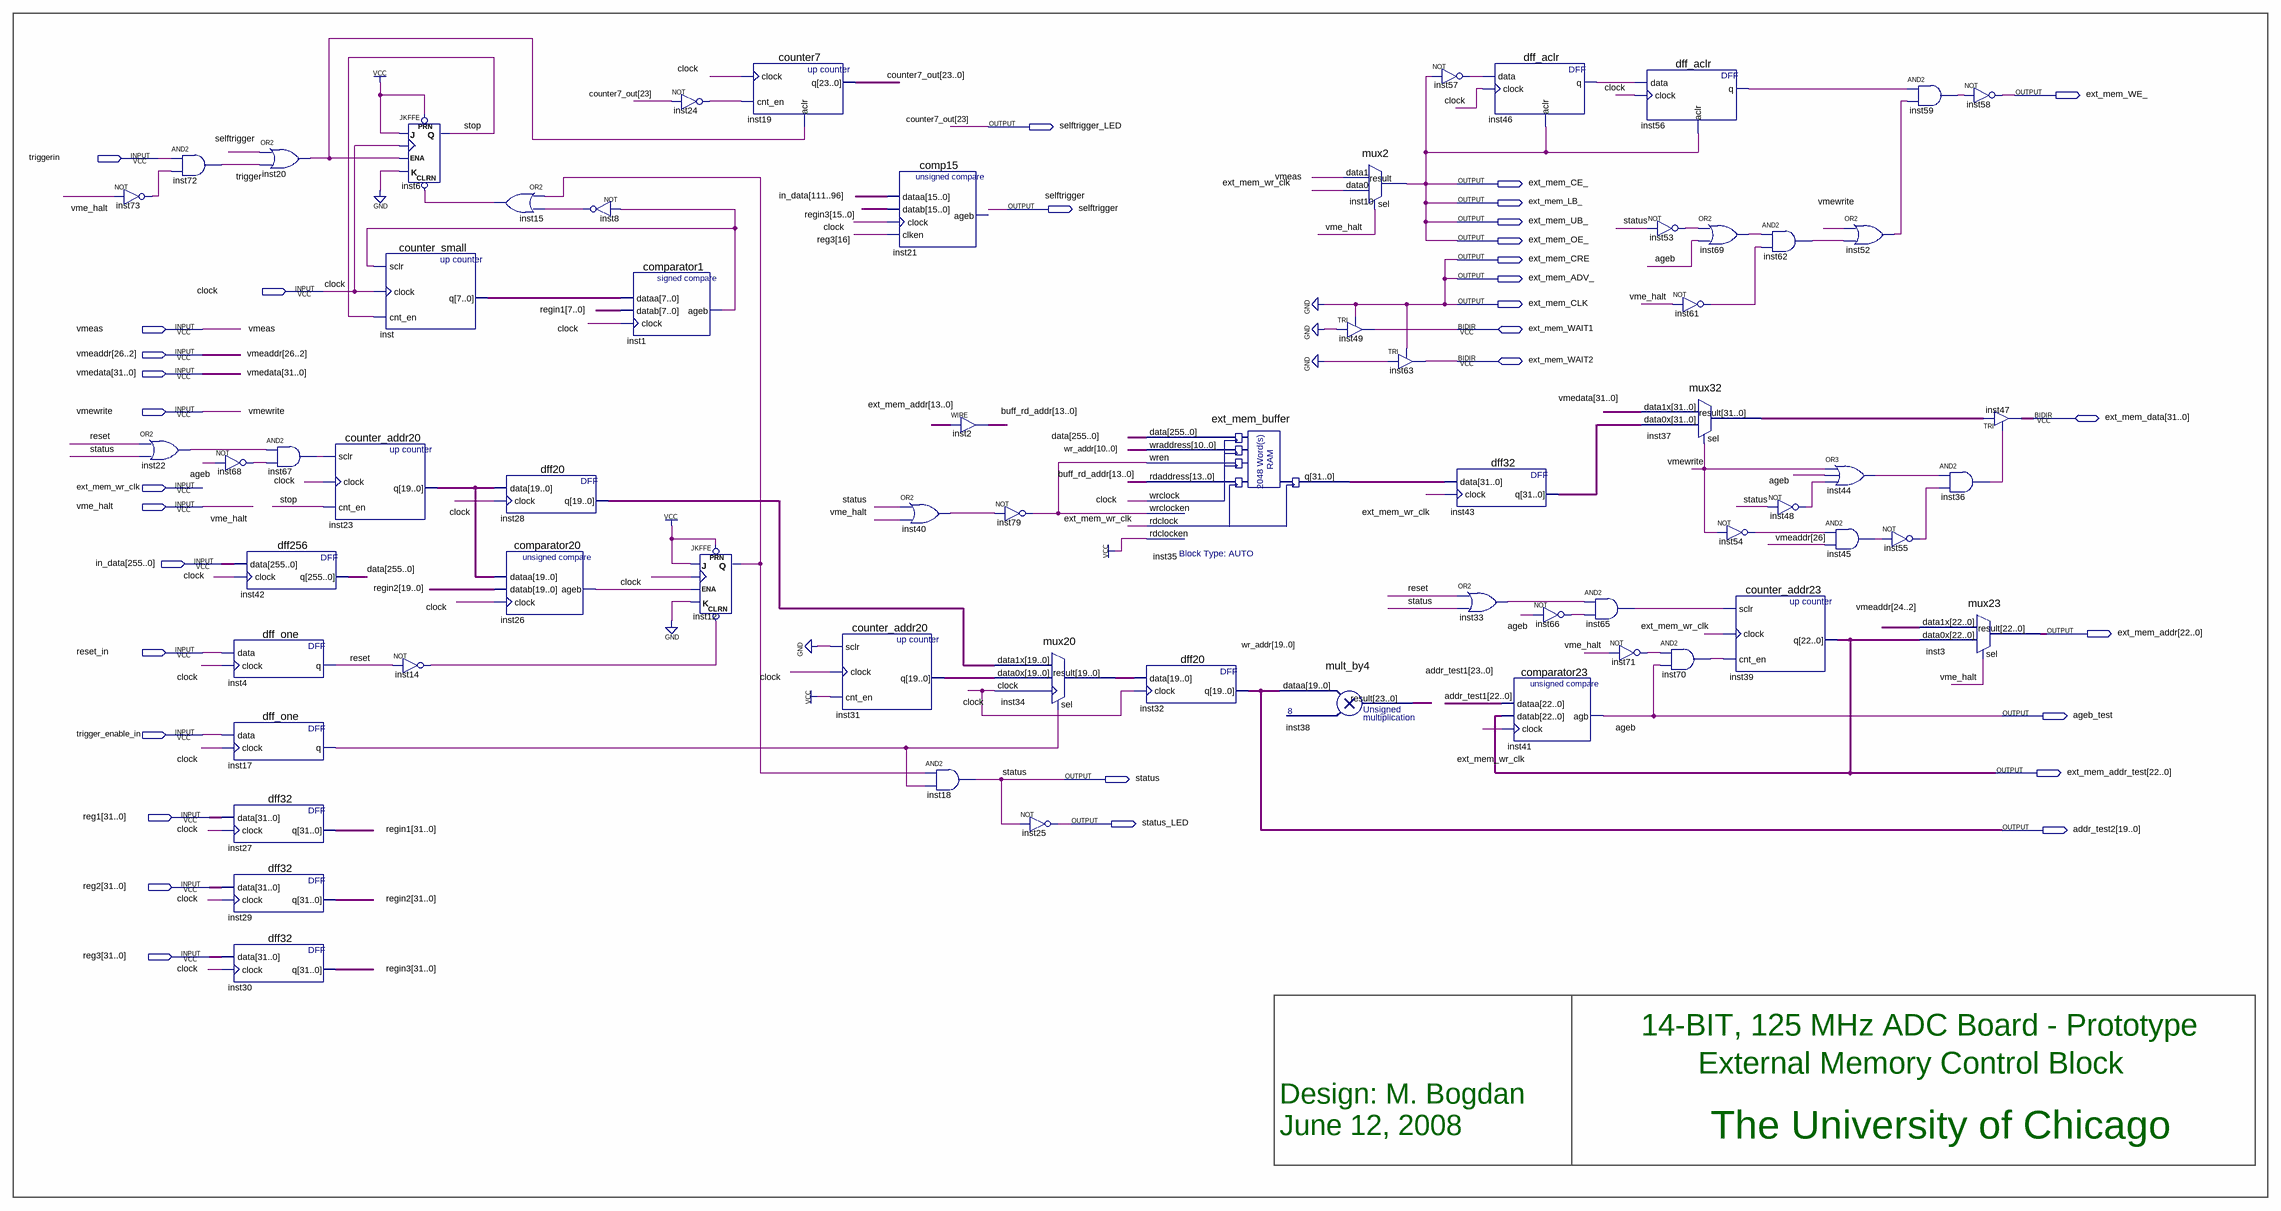
[diagram p0: schematic sheet]
// Quartus schematic ext_mem_trigger_control.bdf as structural Verilog: 65 symbols, 33 pins
module ext_mem_trigger_control (
  input  triggerin,
  input  clock,
  input  vmeas,
  input  [26:2] vmeaddr,
  input  [31:0] vmedata,
  input  vmewrite,
  input  ext_mem_wr_clk,
  input  vme_halt,
  input  [255:0] in_data,
  input  reset_in,
  input  trigger_enable_in,
  input  [31:0] reg1,
  input  [31:0] reg2,
  input  [31:0] reg3,
  inout  ext_mem_WAIT1,
  inout  ext_mem_WAIT2,
  inout  [31:0] ext_mem_data,
  output ext_mem_WE_,
  output selftrigger_LED,
  output ext_mem_CE_,
  output ext_mem_LB_,
  output selftrigger,
  output ext_mem_UB_,
  output ext_mem_OE_,
  output ext_mem_CRE,
  output ext_mem_ADV_,
  output ext_mem_CLK,
  output [22:0] ext_mem_addr,
  output ageb_test,
  output [22:0] ext_mem_addr_test,
  output status,
  output status_LED,
  output [19:0] addr_test2
);

  wire inst1_ageb, inst8_out, inst12_q, inst14_out, inst15_out, inst17_q, inst20_out, inst22_out, inst24_out,
       inst26_ageb, inst33_out, inst36_out, inst40_out, inst44_out, inst45_out, inst46_q, inst48_out,
       inst52_out, inst53_out, inst54_out, inst55_out, inst56_q, inst57_out, inst59_out, inst61_out,
       inst62_out, inst65_out, inst66_out, inst67_out, inst68_out, inst69_out, inst70_out, inst71_out,
       inst73_out, inst79_out, reset, stop, trigger;
  wire [7:0] inst_q;
  wire [13:0] buff_rd_addr;
  wire [19:0] inst23_q, inst28_q, inst31_q, inst34_result;
  wire [22:0] counter7_out;
  wire [23:0] addr_test1;
  wire [31:0] inst35_q, inst37_result, inst43_q, regin1, regin2, regin3;
  wire [255:0] data;

  not inst73 (inst73_out, vme_halt);
  or inst22 (inst22_out, reset, status);
  and inst72 (trigger, triggerin, inst73_out);
  not inst68 (inst68_out, ageb_test);
  dff256 inst42 (.data(in_data), .clock(clock), .q(data));
  dff_one inst4 (.data(reset_in), .clock(clock), .q(reset));
  dff_one inst17 (.data(trigger_enable_in), .clock(clock), .q(inst17_q));
  dff32 inst27 (.data(reg1), .clock(clock), .q(regin1));
  dff32 inst29 (.data(reg2), .clock(clock), .q(regin2));
  dff32 inst30 (.data(reg3), .clock(clock), .q(regin3));
  or inst20 (inst20_out, selftrigger, trigger);
  and inst67 (inst67_out, inst22_out, inst68_out);
  counter_addr20 inst23 (.sclr(inst67_out), .clock(clock), .cnt_en(stop), .q(inst23_q));
  JKFFE inst6 (.PRN(1'b1), .J(1'b1), .CLK(clock), .CLRN(inst15_out), .K(1'b0), .ENA(inst20_out), .Q(stop));
  counter_small inst (.sclr(inst1_ageb), .clock(clock), .cnt_en(stop), .q(inst_q));
  not inst14 (inst14_out, reset);
  or inst15 (inst15_out, inst12_q, inst8_out);
  dff20 inst28 (.data(inst23_q), .clock(clock), .q(inst28_q));
  comparator20 inst26 (.dataa(inst23_q), .datab(regin2[19:0]), .clock(clock), .ageb(inst26_ageb));
  not inst8 (inst8_out, inst1_ageb);
  comparator1 inst1 (.dataa(inst_q), .datab(regin1[7:0]), .clock(clock), .ageb(inst1_ageb));
  not inst24 (inst24_out, selftrigger_LED);
  JKFFE inst12 (.PRN(1'b1), .J(1'b1), .CLK(clock), .CLRN(inst14_out), .K(1'b0), .ENA(inst26_ageb), .Q(inst12_q));
  counter7 inst19 (.clock(clock), .cnt_en(inst24_out), .aclr(inst20_out), .q({selftrigger_LED, counter7_out}));
  counter_addr20 inst31 (.sclr(1'b0), .clock(clock), .cnt_en(1'b1), .q(inst31_q));
  comp15 inst21 (.dataa(in_data[111:96]), .datab(regin3[15:0]), .clock(clock), .clken(reg3[16]));  // open: ageb
  or inst40 (inst40_out, status, vme_halt);
  assign buff_rd_addr = ext_mem_addr[13:0];  // WIRE inst2
  and inst18 (status, inst12_q, inst17_q);
  not inst79 (inst79_out, inst40_out);
  mux20 inst34 (.data1x(inst28_q), .data0x(inst31_q), .clock(clock), .sel(inst17_q), .result(inst34_result));
  not inst25 (status_LED, status);
  ext_mem_buffer inst35 (
    .data(data), .wraddress(addr_test2[10:0]), .wren(inst79_out), .rdaddress(buff_rd_addr), .wrclock(clock),
    .wrclocken(inst79_out), .rdclock(ext_mem_wr_clk), .rdclocken(1'b1), .q(inst35_q));
  dff20 inst32 (.data(inst34_result), .clock(clock), .q(addr_test2));
  mult_by4 inst38 (.dataa(addr_test2), .result(addr_test1));
  mux2 inst10 (.data1(vmeas), .data0(ext_mem_wr_clk), .sel(vme_halt), .result(ext_mem_CE_));
  TRI inst49 (.IN(1'b0), .OE(1'b0), .OUT(ext_mem_WAIT1));
  TRI inst63 (.IN(1'b0), .OE(1'b0), .OUT(ext_mem_WAIT2));
  not inst57 (inst57_out, ext_mem_CE_);
  dff32 inst43 (.data(inst35_q), .clock(ext_mem_wr_clk), .q(inst43_q));
  or inst33 (inst33_out, reset, status);
  dff_aclr inst46 (.data(inst57_out), .clock(clock), .aclr(ext_mem_CE_), .q(inst46_q));
  comparator23 inst41 (.dataa(addr_test1[22:0]), .datab(ext_mem_addr_test), .clock(ext_mem_wr_clk), .agb(ageb_test));
  not inst66 (inst66_out, ageb_test);
  and inst65 (inst65_out, inst33_out, inst66_out);
  not inst71 (inst71_out, vme_halt);
  dff_aclr inst56 (.data(inst46_q), .clock(clock), .aclr(ext_mem_CE_), .q(inst56_q));
  not inst53 (inst53_out, status);
  not inst61 (inst61_out, vme_halt);
  mux32 inst37 (.data1x(vmedata), .data0x(inst43_q), .sel(vmewrite), .result(inst37_result));
  and inst70 (inst70_out, inst71_out, ageb_test);
  or inst69 (inst69_out, inst53_out, ageb_test);
  not inst54 (inst54_out, vmewrite);
  counter_addr23 inst39 (.sclr(inst65_out), .clock(ext_mem_wr_clk), .cnt_en(inst70_out), .q(ext_mem_addr_test));
  and inst62 (inst62_out, inst69_out, inst61_out);
  not inst48 (inst48_out, status);
  or inst44 (inst44_out, vmewrite, ageb_test, inst48_out);
  and inst45 (inst45_out, inst54_out, vmeaddr[26]);
  or inst52 (inst52_out, vmewrite, inst62_out);
  and inst59 (inst59_out, inst56_q, inst52_out);
  not inst55 (inst55_out, inst45_out);
  mux23 inst3 (.data1x(vmeaddr[24:2]), .data0x(ext_mem_addr_test), .sel(vme_halt), .result(ext_mem_addr));
  not inst58 (ext_mem_WE_, inst59_out);
  and inst36 (inst36_out, inst44_out, inst55_out);
  TRI inst47[31:0] (.IN(inst37_result), .OE(inst36_out), .OUT(ext_mem_data));

  assign ext_mem_ADV_ = 1'b0;
  assign ext_mem_CLK = 1'b0;
  assign ext_mem_CRE = 1'b0;
  assign ext_mem_LB_ = ext_mem_CE_;
  assign ext_mem_OE_ = ext_mem_CE_;
  assign ext_mem_UB_ = ext_mem_CE_;

  // Other names for the same wires on the sheet: ageb = ageb_test; counter7_out[23] = selftrigger_LED;
  //   wr_addr[19:0] = addr_test2

  // Notes on the sheet:
  //   14-BIT, 125 MHz ADC Board - Prototype
  //   External Memory Control Block
  //   Design: M. Bogdan
  //   The University of Chicago
  //   June 12, 2008
endmodule
